# EAGLE design c50 (EAGLE 7.2.0)
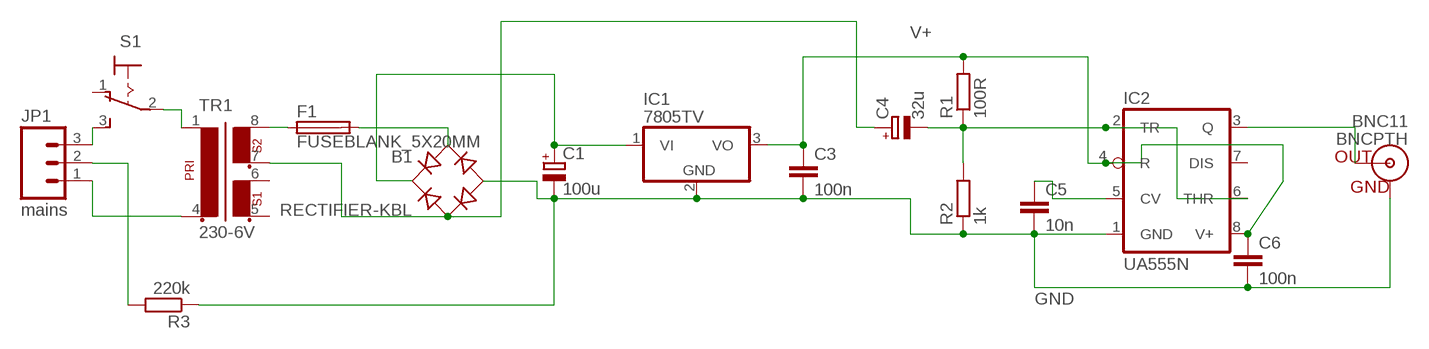
[diagram p0: schematic, sheet 1]

## Parts
B1  RECTIFIER-KBL  B-DIL  [B-DIL]
BNC11  BNCPTH  [BNC]
C1  100u  CPOL-EUE2.5-7  [E2,5-7]
C3  100n  C-EU050-024X044  [C050-024X044]
C4  32u  CPOL-EUE5-13  [E5-13]
C5  10n  C-EU050-024X044  [C050-024X044]
C6  100n  C-EU050-024X044  [C050-024X044]
F1  FUSEBLANK_5X20MM  [FUSE_HOLDER_5X20MM]
IC1  7805TV  [TO220V]
IC2  UA555N  [DIL08]
JP1  mains  M03-SCREW-5MM  [SCREWTERMINAL-5MM-3]
R1  100R  R-EU_0207/10  [0207/10]
R2  1k  R-EU_0207/10  [0207/10]
R3  220k  R-EU_0207/10  [0207/10]
S1  320-916  [320-916]
TR1  230-6V  EE20-2  [EE20-2]

## Nets
GND [ground]: B1.- BNC11.GND C1.- C3.2 C5.2 C6.2 IC1.2(GND) IC2.1(GND) R2.1 R3.1
N$1: S1.2(P) TR1.1
N$2: B1.AC2 C4.+ TR1.7
N$3: JP1.1 TR1.4
N$4: JP1.2 R3.2
N$5: B1.+ C1.+ IC1.1(VI)
N$6: F1.1 TR1.8
N$7: C5.1 IC2.5(CV)
N$8: C4.- IC2.2(TR) IC2.6(THR) R1.1 R2.2
N$9: BNC11.S(OUT) IC2.3(Q)
N$10: JP1.3 S1.3(S)
N$13: B1.AC1 F1.2
V+: C3.1 C6.1 IC1.3(VO) IC2.4(R) IC2.8(V+) R1.2
Unconnected: IC2.7(DIS) S1.1(O) TR1.5 TR1.6

## Library data of the parts
B1 = rectifier:B-DIL: RECTIFIER
BNC11 = SparkFun-Connectors:BNC: BNC Connector, Mouser Part# 5227161
C1 C4 = rcl:CPOL-EU: POLARIZED CAPACITOR, European symbol
C3 C5 C6 = resistor:C-EU: CAPACITOR, European symbol
F1 = fuse:FUSE: Fuse; OC_FARNELL: unknown; OC_NEWARK: unknown
IC1 = linear:78*: Positive VOLTAGE REGULATOR Source: http://cache.national.com/ds/LM/LM78L05.pdf http://www.fairchildsemi.com/ds/LM/LM7805.pdf
IC2 = linear:*555: TIMER
JP1 = SparkFun-Connectors:M03: Header 3 Standard 3-pin 0.1" header. Use with straight break away headers (SKU : PRT-00116), right angle break away headers (PRT-00553), swiss pins (PRT-00743), machine pins (PRT-00117), and female headers (PRT-00115). Molex polarized connector foot print use with SKU : PRT-08232 with associated crimp pins and housings.; STOREFRONT_ID: PRT-08433
R1-R3 = resistor:R-EU_: RESISTOR, European symbol
S1 = switch:320-916: TOGGLE SWITCH distributor RS Components
TR1 = trafo:EE20-2: TRANSFORMER 1 primary winding, 2 secondary windings ERA

## Net classes
0 default: width 0.508 mm
1 mask: clearance 0.254 mm to class 0
2 ground: width 1.016 mm, drill 0.991 mm

## Board
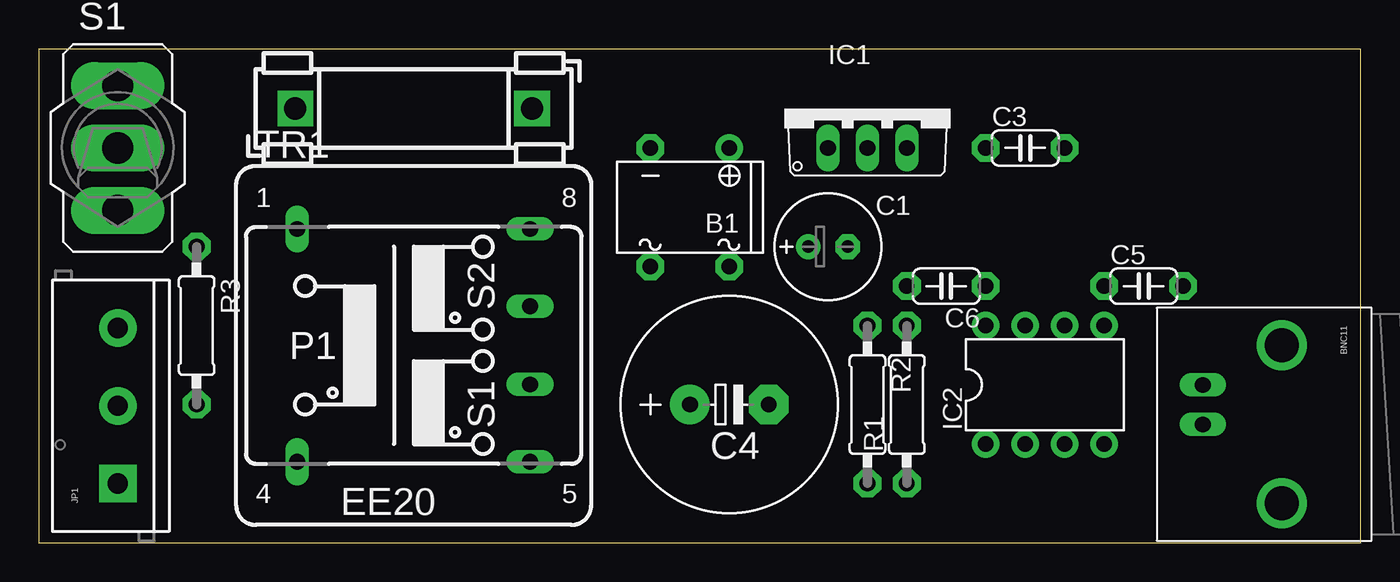
[diagram p1: board, top side]
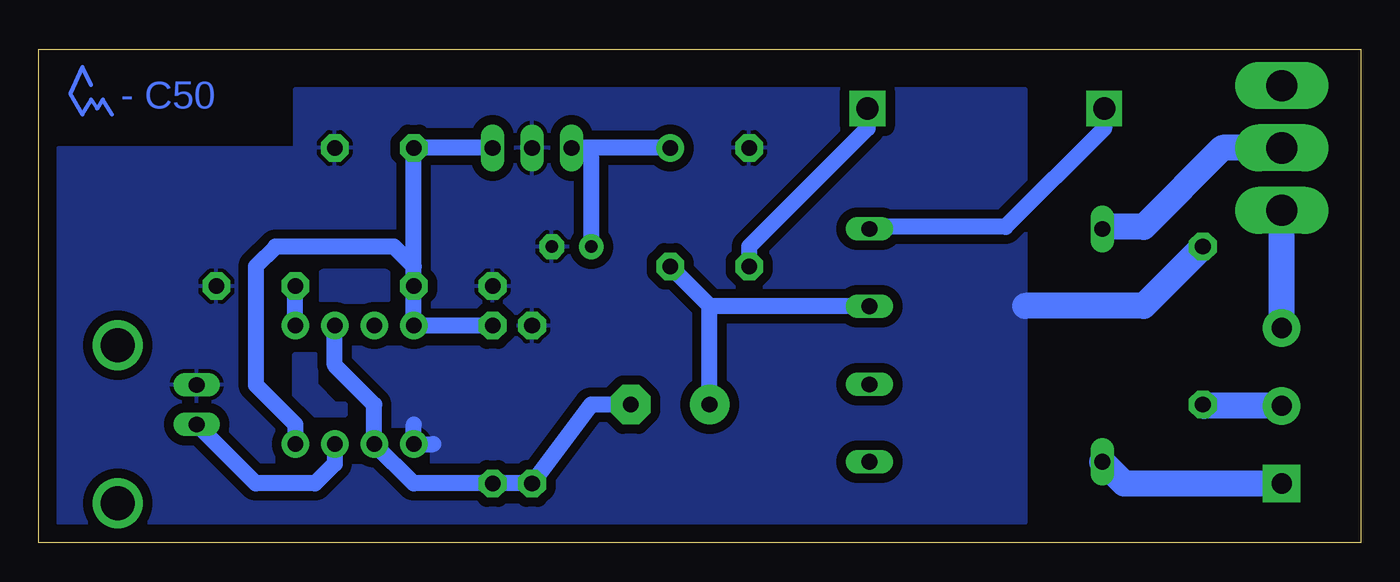
[diagram p2: board, bottom side, seen from below]

Size 85.09 x 31.75 mm. Coordinates in mm from the lower left corner, seen from the top.
Outline: 0,0 85.09,0 85.09,31.75 0,31.75 0,0
Copper layers (1*16): Top 0.035mm / dielectric 1.5mm / Bottom 0.035mm
Design rules "fresa *": minimum track width 1mm, minimum drill 0.7mm, track to track 24mil, track to pad 14mil, pad to pad 14mil, via to via 14mil, smd to smd 10mil, copper to edge 14mil, drill to drill 1.3mm, minimum pad ring 10mil, minimum via ring 8mil, stop-mask expansion 4mil, vias tented up to drill 0mil, thermal gap 10mil
bRestrict: area 55.9,12.7 to 68.6,14; area 61,6.3 to 64.8,7.4; area 61,5.1 to 66.8,6.3; area 59.9,4.8 to 61.5,5.8; area 53.3,4.3 to 60.2,5.1; area 57.2,25.9 to 60.5,26.7; area 56.9,25.9 to 57.1,26.7; area 68.6,5.1 to 69.8,7.6; area 68.6,3.8 to 71.1,5.1; area 53.3,2.5 to 55.9,3.8

### Footprints (pad centres in the part's own frame; a part is rotated, then mirrored left to right if it is on the bottom)
B-DIL = drill 1 pad 1.778: + -2.54,-3.81 | drill 1 pad 1.778 octagon: - 2.54,-3.81; AC1 2.54,3.81; AC2 -2.54,3.81
BNC = drill 2.2: 3 -5.08,5.08; 4 5.08,5.08 | drill 1 long: GND -2.54,0; S 0,0
E2,5-7 = drill 0.813 pad 1.6: + -1.27,0 | drill 0.813 pad 1.6 octagon: - 1.27,0
C050-024X044 = drill 1 pad 1.778 octagon: 1 -2.54,0; 2 2.54,0
E5-13 = drill 1.016 pad 2.54: + -2.54,0 | drill 1.016 pad 2.54 octagon: - 2.54,0
FUSE_HOLDER_5X20MM = drill 1.422 pad 2.286 square: 1 0,0; 2 15.24,0
TO220V = drill 1.016 long: 1 -2.54,-2.54; 2 0,-2.54; 3 2.54,-2.54
DIL08 = drill 1 pad 1.778: 1 -3.81,-3.81; 2 -1.27,-3.81; 3 1.27,-3.81; 4 3.81,-3.81; 5 3.81,3.81; 6 1.27,3.81; 7 -1.27,3.81; 8 -3.81,3.81
SCREWTERMINAL-5MM-3 = drill 1.3 pad 2.413 square: 1 0,0 | drill 1.3 pad 2.413: 2 5,0; 3 10,0
0207/10 = drill 1 pad 1.778 octagon: 1 -5.08,0; 2 5.08,0
320-916 = drill 2.007 long: 1 0,4.013; 2 0,0; 3 0,-4.013
EE20-2 = drill 1.016 long: 1 -7.493,7.493; 4 -7.493,-7.493; 5 7.493,-7.493; 6 7.493,-2.515; 7 7.493,2.515; 8 7.493,7.493

### Placement (x,y rotation side)
B1  41.91,21.59 180 top
BNC11  74.93,7.62 270 top
C1  50.8,19.05 0 top
C3  63.5,25.4 0 top
C4  44.45,8.89 0 top
C5  71.12,16.51 0 top
C6  58.42,16.51 180 top
F1  16.51,27.94 0 top
IC1  53.34,27.94 0 top
IC2  64.77,10.16 0 top
JP1  5.08,3.81 90 top
R1  55.88,8.89 90 top
R2  53.34,8.89 270 top
R3  10.16,13.97 270 top
S1  5.08,25.4 0 top
TR1  24.13,12.7 0 top

### Tracks (layer width: path | path; a pad name or v marks a point on that pad's centre or on a via)
GND
  Bottom 1.016: 59.69,6.35 IC2.1 60.96,7.62
  Bottom 1.676: R3.1 13.97,15.24 21.59,15.24
  pour Bottom: 83.82,1.27 83.82,25.4 68.58,25.4 68.58,29.21 21.59,29.21 21.59,1.27
N$1
  Bottom 1.016: 16.51,20.32 TR1.1
  Bottom 1.676: S1.2 8.89,25.4 13.97,20.32 16.51,20.32
N$2
  Bottom 1.016: TR1.7 41.88,15.21 | 41.88,15.21 B1.AC2 | C4.+ 41.91,15.19 41.88,15.21
N$3
  Bottom 1.676: TR1.4 15.24,3.81 JP1.1
N$4
  Bottom 1.016: 10.08,8.81 R3.2
  Bottom 1.676: JP1.2 10.08,8.81
N$5
  Bottom 1.016: B1.+ IC1.1 50.16,25.4 49.53,24.77 C1.+
N$6
  Bottom 1.016: F1.1 16.51,26.67 22.86,20.32 31.5,20.32 TR1.8
N$7
  Bottom 1.016: IC2.5 C5.1
N$8
  Bottom 1.016: C4.- 49.53,8.89 R2.2 R1.1 60.96,3.81 IC2.2 63.5,8.89 66.04,11.43 IC2.6
N$9
  Bottom 1.016: IC2.3 66.04,5.08 67.31,3.81 71.12,3.81 BNC11.S
N$10
  Bottom 1.676: JP1.3 S1.3
N$11
  Bottom 0.254: 81.72,29.46 82.3,30.61 83.06,28.89 82.3,27.56 81.72,28.51 81.34,27.94 80.96,28.51 80.39,27.56
N$12
  pour Bottom: 62.87,17.14 62.87,15.88 66.67,15.88 66.67,16.51 66.67,17.14 63.5,17.14
N$13
  Bottom 1.016: F1.2 31.75,26.67 39.37,19.05 B1.AC1
N$15
  pour Bottom (no thermals): 65.41,8.26 67.31,8.26 68.58,9.53 68.58,12.06 67.31,12.06 67.31,10.16 66.04,8.89 65.41,8.89
V+
  Bottom 1.016: IC1.3 C3.1 60.96,17.78 | 60.96,17.78 C6.1 IC2.8 R1.2 | IC2.4 68.58,7.62 71.12,10.16 71.12,17.78 69.85,19.05 62.23,19.05 60.96,17.78

### Text on the board
Bottom: - C50